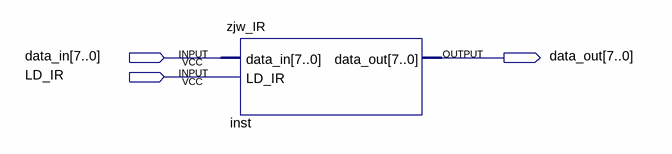
[diagram p0: schematic sheet]
// Quartus schematic Block1.bdf as structural Verilog: 1 symbols, 3 pins
module Block1 (
  input  [7:0] data_in,
  input  LD_IR,
  output [7:0] data_out
);

  zjw_IR inst (.data_in(data_in), .LD_IR(LD_IR), .data_out(data_out));
endmodule
